# EAGLE design TeensyViewSideTest (EAGLE 7.5.0)
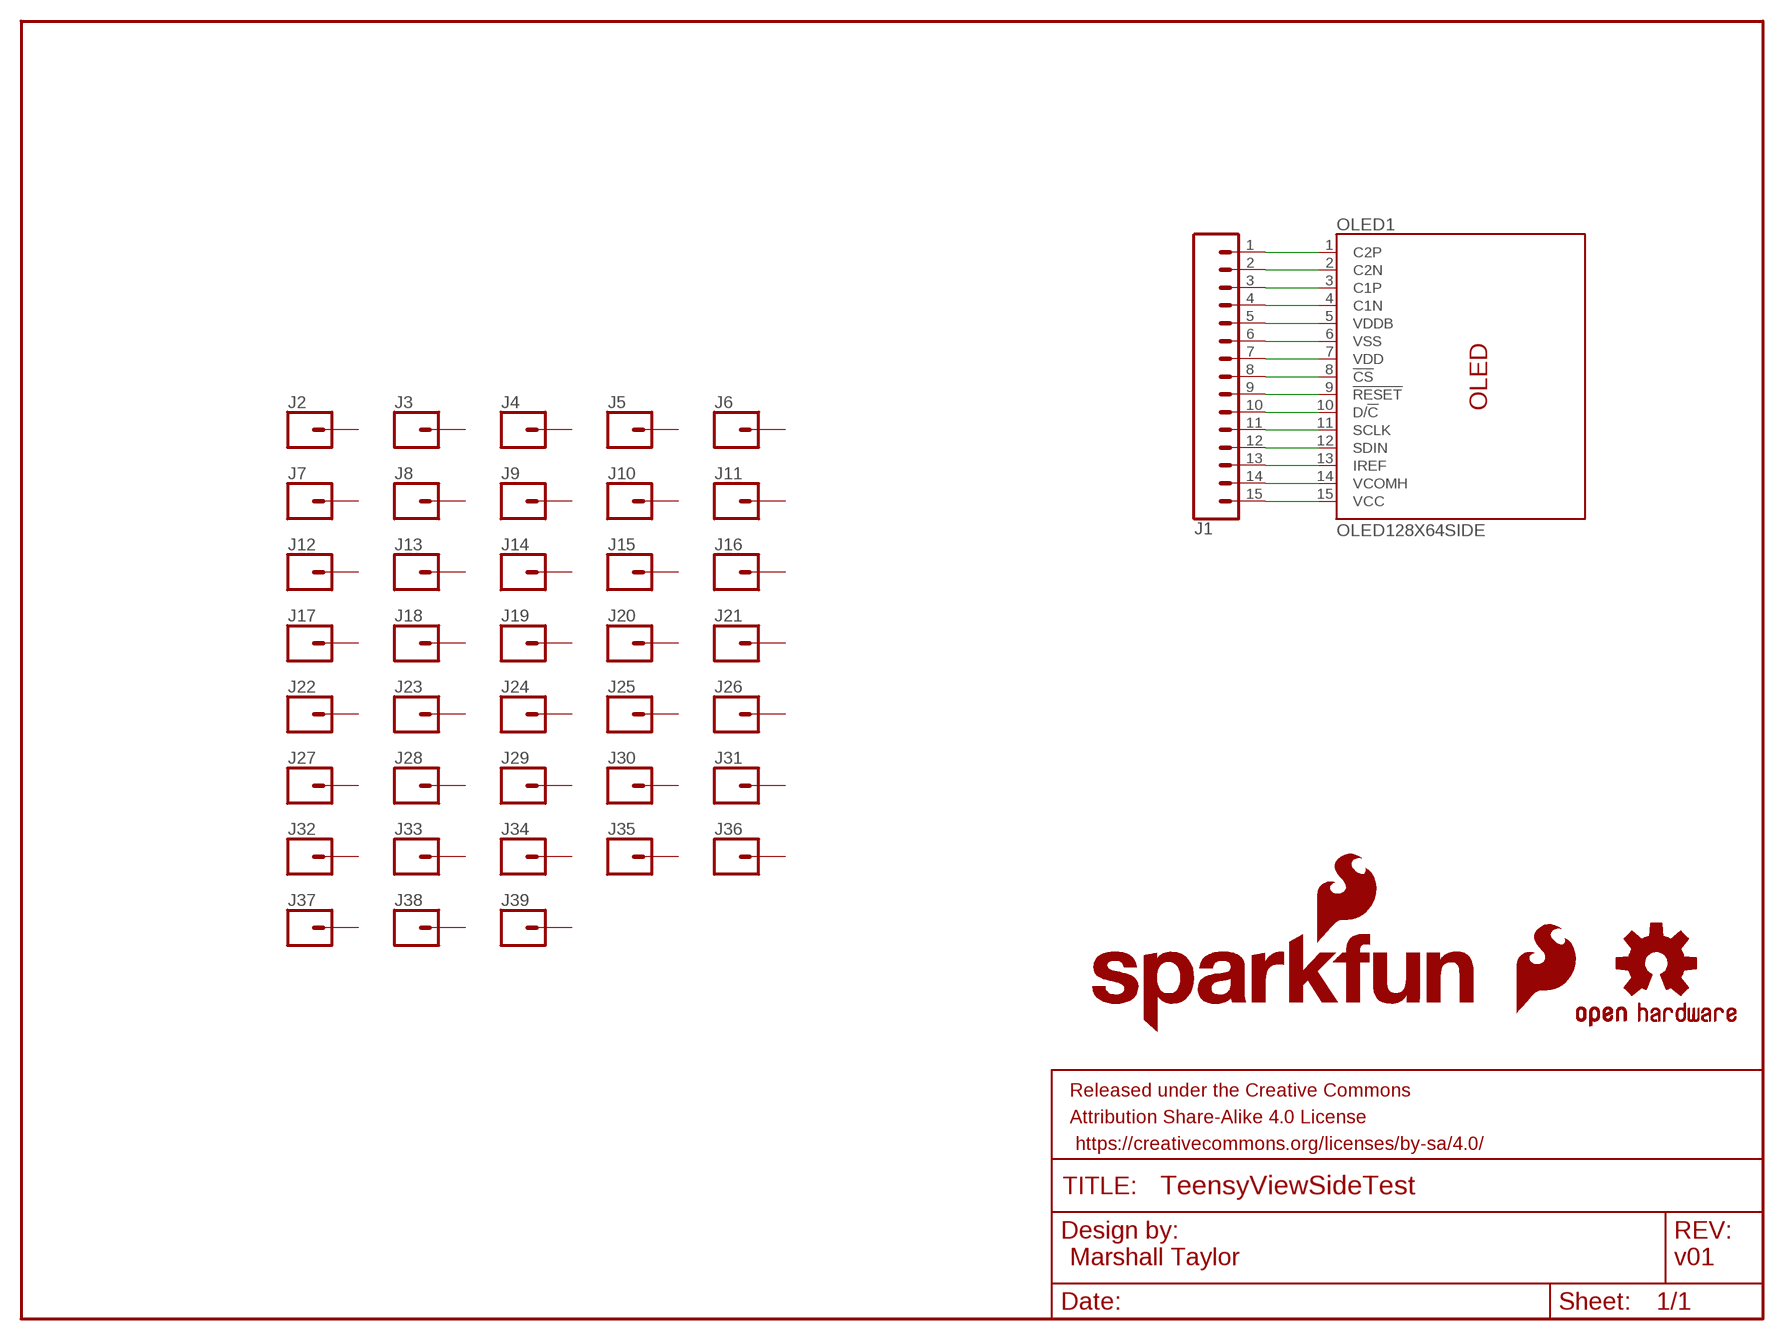
[diagram p0: schematic, sheet 1]

## Parts
FRAME1  FRAME-LETTER  [CREATIVE_COMMONS]
J1  CONN_15  [1X15]
J2  CONN_01PTH_NO_SILK_YES_STOP  [1X01_NO_SILK]
J3  CONN_01PTH_NO_SILK_YES_STOP  [1X01_NO_SILK]
J4  CONN_01PTH_NO_SILK_YES_STOP  [1X01_NO_SILK]
J5  CONN_01PTH_NO_SILK_YES_STOP  [1X01_NO_SILK]
J6  CONN_01PTH_NO_SILK_YES_STOP  [1X01_NO_SILK]
J7  CONN_01PTH_NO_SILK_YES_STOP  [1X01_NO_SILK]
J8  CONN_01PTH_NO_SILK_YES_STOP  [1X01_NO_SILK]
J9  CONN_01PTH_NO_SILK_YES_STOP  [1X01_NO_SILK]
J10  CONN_01PTH_NO_SILK_YES_STOP  [1X01_NO_SILK]
J11  CONN_01PTH_NO_SILK_YES_STOP  [1X01_NO_SILK]
J12  CONN_01PTH_NO_SILK_YES_STOP  [1X01_NO_SILK]
J13  CONN_01PTH_NO_SILK_YES_STOP  [1X01_NO_SILK]
J14  CONN_01PTH_NO_SILK_YES_STOP  [1X01_NO_SILK]
J15  CONN_01PTH_NO_SILK_YES_STOP  [1X01_NO_SILK]
J16  CONN_01PTH_NO_SILK_YES_STOP  [1X01_NO_SILK]
J17  CONN_01PTH_NO_SILK_YES_STOP  [1X01_NO_SILK]
J18  CONN_01PTH_NO_SILK_YES_STOP  [1X01_NO_SILK]
J19  CONN_01PTH_NO_SILK_YES_STOP  [1X01_NO_SILK]
J20  CONN_01PTH_NO_SILK_YES_STOP  [1X01_NO_SILK]
J21  CONN_01PTH_NO_SILK_YES_STOP  [1X01_NO_SILK]
J22  CONN_01PTH_NO_SILK_YES_STOP  [1X01_NO_SILK]
J23  CONN_01PTH_NO_SILK_YES_STOP  [1X01_NO_SILK]
J24  CONN_01PTH_NO_SILK_YES_STOP  [1X01_NO_SILK]
J25  CONN_01PTH_NO_SILK_YES_STOP  [1X01_NO_SILK]
J26  CONN_01PTH_NO_SILK_YES_STOP  [1X01_NO_SILK]
J27  CONN_01PTH_NO_SILK_YES_STOP  [1X01_NO_SILK]
J28  CONN_01PTH_NO_SILK_YES_STOP  [1X01_NO_SILK]
J29  CONN_01PTH_NO_SILK_YES_STOP  [1X01_NO_SILK]
J30  CONN_01PTH_NO_SILK_YES_STOP  [1X01_NO_SILK]
J31  CONN_01PTH_NO_SILK_YES_STOP  [1X01_NO_SILK]
J32  CONN_01PTH_NO_SILK_YES_STOP  [1X01_NO_SILK]
J33  CONN_01PTH_NO_SILK_YES_STOP  [1X01_NO_SILK]
J34  CONN_01PTH_NO_SILK_YES_STOP  [1X01_NO_SILK]
J35  CONN_01PTH_NO_SILK_YES_STOP  [1X01_NO_SILK]
J36  CONN_01PTH_NO_SILK_YES_STOP  [1X01_NO_SILK]
J37  CONN_01PTH_NO_SILK_YES_STOP  [1X01_NO_SILK]
J38  CONN_01PTH_NO_SILK_YES_STOP  [1X01_NO_SILK]
J39  CONN_01PTH_NO_SILK_YES_STOP  [1X01_NO_SILK]
LOGO1  SFE_LOGO_FLAME.1_INCH  [SFE_LOGO_FLAME_.1]
LOGO2  OSHW-LOGOS  [OSHW-LOGO-S]
LOGO3  SFE_LOGO_NAME_FLAME.1_INCH  [SFE_LOGO_NAME_FLAME_.1]
OLED1  OLED128X64SIDE  [OLED-UG-2832TSWGG01]

## Nets
N$1: J1.1 OLED1.1(C2P)
N$2: J1.2 OLED1.2(C2N)
N$3: J1.3 OLED1.3(C1P)
N$4: J1.4 OLED1.4(C1N)
N$5: J1.5 OLED1.5(VDDB)
N$6: J1.6 OLED1.6(VSS)
N$7: J1.7 OLED1.7(VDD)
N$8: J1.8 OLED1.8(!CS!)
N$9: J1.9 OLED1.9(!RESET!)
N$10: J1.10 OLED1.10(D/!C!)
N$11: J1.11 OLED1.11(SCLK)
N$12: J1.12 OLED1.12(SDIN)
N$13: J1.13 OLED1.13(IREF)
N$14: J1.14 OLED1.14(VCOMH)
N$15: J1.15 OLED1.15(VCC)
Unconnected: J2.1 J3.1 J4.1 J5.1 J6.1 J7.1 J8.1 J9.1 J10.1 J11.1 J12.1 J13.1 J14.1 J15.1 J16.1 J17.1 J18.1 J19.1 J20.1 J21.1 J22.1 J23.1 J24.1 J25.1 J26.1 J27.1 J28.1 J29.1 J30.1 J31.1 J32.1 J33.1 J34.1 J35.1 J36.1 J37.1 J38.1 J39.1

## Notes on the sheet
- Marshall Taylor | v01

## Library data of the parts
FRAME1 = SparkFun-Aesthetics:FRAME-LETTER: Schematic Frame - Letter Standard 8.5x11 US Letter frame
J1 = SparkFun-Connectors:CONN_15: Multi connection point. Often used as Generic Header-pin footprint for 0.1 inch spaced/style header connections On any of the 0.1 inch spaced packages, you can populate with these: Break Away Headers - Straight <https://www.sparkfun.com/products/116> (PRT-00116) Break Away Male Headers - Right Angle <https://www.sparkfun.com/products/553> (PRT-00553) Female Headers <https://www.sparkfun.com/products/115> (PRT-00115) Break Away Headers - Machine Pin <https://www.sparkfun.com/products/117> (PRT-00117) Break Away Female Headers - Swiss Machine Pin <https://www.sparkfun.com/products/743> (PRT-00743) For SCREWTERMINALS and SPRING TERMINALS visit here: Screw Terimnals on SparkFun.com <https://www.sparkfun.com/search/results?term=Screw+Terminals> (5mm/3.5mm/2.54mm spacing) This device is also useful as a general connection point to wire up your design to another part of your project. Our various solder wires solder well into these plated through hole pads. Hook-Up Wire - Assortment (Stranded, 22 AWG) <https://www.sparkfun.com/products/11375> (PRT-11375) Hook-Up Wire - Assortment (Solid Core, 22 AWG) <https://www.sparkfun.com/products/11367> (PRT-11367) View the entire wire category on our website here <https://www.sparkfun.com/categories/141> Special notes: Molex polarized connector foot print use with SKU : PRT-08231 with associated crimp pins and housings. 1MM SMD Version SKU: PRT-10208 NOTES ON THE VARIANTS LOCK and LOCK_LONGPADS... This footprint was designed to help hold the alignment of a through-hole component (i.e. 6-pin header) while soldering it into place. You may notice that each hole has been shifted either up or down by 0.005 of an inch from it's more standard position (which is a perfectly straight line). This slight alteration caused the pins (the squares in the middle) to touch the edges of the holes. Because they are alternating, it causes a "brace" to hold the component in place. 0.005 has proven to be the perfect amount of "off-center" position when using our standard breakaway headers. Although looks a little odd when you look at the bare footprint, once you have a header in there, the alteration is very hard to notice. Also,if you push a header all the way into place, it is covered up entirely on the bottom side.
J2-J39 = SparkFun-Connectors:CONN_01: Single connection point. Often used as Generic Header-pin footprint for 0.1 inch spaced/style header connections On any of the 0.1 inch spaced packages, you can populate with these: Break Away Headers - Straight <https://www.sparkfun.com/products/116> (PRT-00116) Break Away Male Headers - Right Angle <https://www.sparkfun.com/products/553> (PRT-00553) Female Headers <https://www.sparkfun.com/products/115> (PRT-00115) Break Away Headers - Machine Pin <https://www.sparkfun.com/products/117> (PRT-00117) Break Away Female Headers - Swiss Machine Pin <https://www.sparkfun.com/products/743> (PRT-00743) This device is also useful as a general connection point to wire up your design to another part of your project. Our various solder wires solder well into these plated through hole pads. Hook-Up Wire - Assortment (Stranded, 22 AWG) <https://www.sparkfun.com/products/11375> (PRT-11375) Hook-Up Wire - Assortment (Solid Core, 22 AWG) <https://www.sparkfun.com/products/11367> (PRT-11367) View the entire wire category on our website here <https://www.sparkfun.com/categories/141> Special notes: SMTSO-256-ET is a "flush mount" nut for a 4-40 screw. We mostly use this on specialty testbeds; it is a nice way to connect hardware to your PCB at an adjustable hieght. Also note, the SNAP packages are for using a snappable style connector. We sell a baggie of snaps and they are also used on two LilyPad designs: Snap Assortment - 30 pack (male and female) <https://www.sparkfun.com/products/11347> (DEV-11347) LilyPad Arduino SimpleSnap <https://www.sparkfun.com/products/10941> (DEV-10941) LilyPad SimpleSnap Protoboard <https://www.sparkfun.com/products/10940> (DEV-10940)
LOGO1 = SparkFun-Aesthetics:SFE_LOGO_FLAME: SparkFun Flame Logo This is the SparkFun flame logo. The logo on the schematic will always be the same size; the package variant is the height of the flame. Default layer for the logo on the board is tSilk.
LOGO2 = SparkFun-Aesthetics:OSHW-LOGO: Open-Source Hardware (OSHW) Logo This logo indicates the piece of hardware it is found on incorporates a OSHW license and/or adheres to the definition of open source hardware found here: http://freedomdefined.org/OSHW
LOGO3 = SparkFun-Aesthetics:SFE_LOGO_NAME_FLAME: SparkFun Font Logo w/ Flame This is the SparkFun full logo. The logo on the schematic will always be the same size; the package variant is the height of the flame part of the logo. Default layer for the logo on the board is tSilk.
OLED1 = SparkFun-Displays:OLED128X64SIDE: Micro OLED TODO: Add description SparkFun Products: Product <https://www.sparkfun.com/products/13003>

## Board
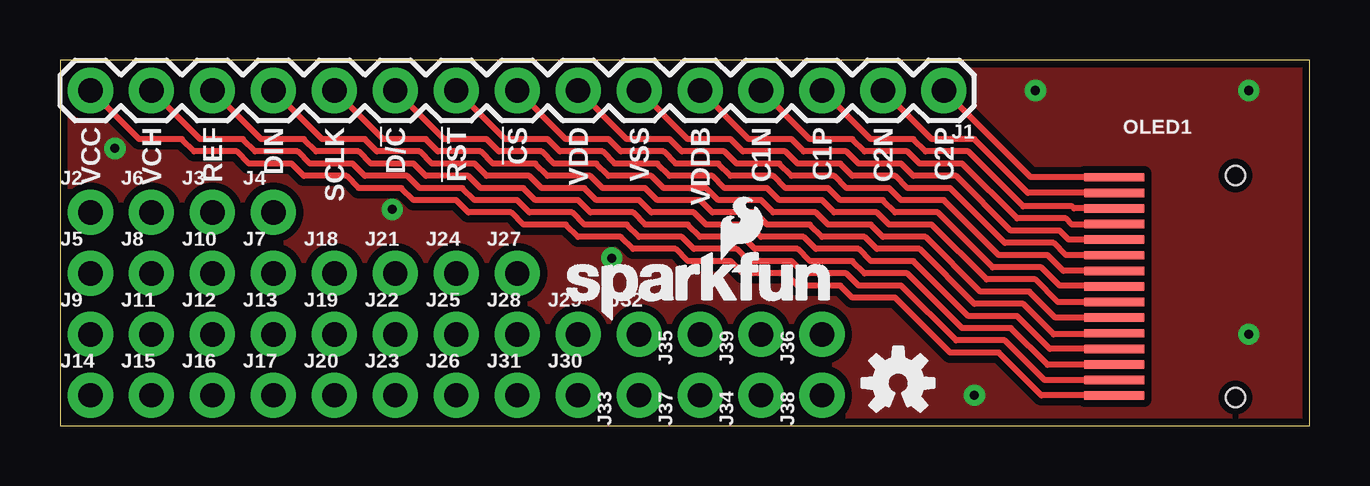
[diagram p1: board, top side]
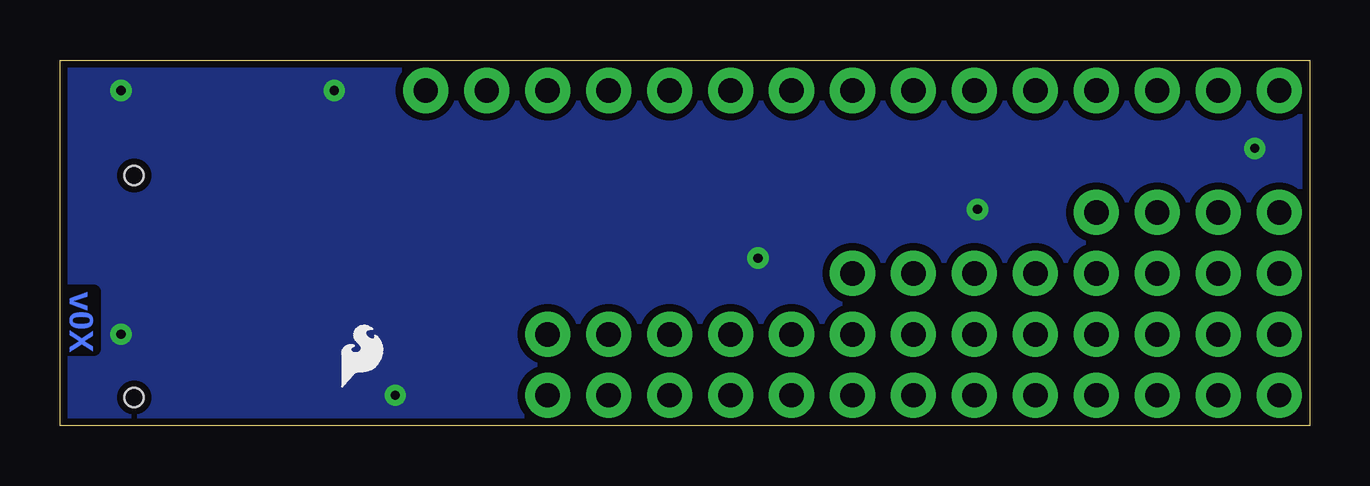
[diagram p2: board, bottom side, seen from below]

Size 52.07 x 15.24 mm. Coordinates in mm from the lower left corner, seen from the top.
Outline: 0,0 52.07,0 52.07,15.24 0,15.24 0,0
Copper layers (1*16): Top 0.035mm / dielectric 1.5mm / Bottom 0.035mm
Design rules "SparkFun-2-layer-STANDARD": minimum track width 10mil, minimum drill 20mil, track to track 10mil, track to pad 8mil, pad to pad 8mil, via to via 10mil, smd to smd 8mil, copper to edge 8mil, drill to drill 8mil, minimum pad ring 10mil, minimum via ring 10mil, stop-mask expansion 4mil, vias tented up to drill 25mil, thermal gap 10mil

### Footprints (pad centres in the part's own frame; a part is rotated, then mirrored left to right if it is on the bottom)
1X15 = drill 1.016 pad 1.88: 1 0,0; 2 2.54,0; 3 5.08,0; 4 7.62,0; 5 10.16,0; 6 12.7,0; 7 15.24,0; 8 17.78,0; 9 20.32,0; 10 22.86,0; 11 25.4,0; 12 27.94,0; 13 30.48,0; 14 33.02,0; 15 35.56,0
1X01_NO_SILK = drill 1.016 pad 1.88: 1 0,0
OLED-UG-2832TSWGG01 = smd 2.5 x 0.35: 1 0.75,-1.075; 2 0.75,-1.725; 3 0.75,-2.375; 4 0.75,-3.025; 5 0.75,-3.675; 6 0.75,-4.325; 7 0.75,-4.975; 8 0.75,-5.625; 9 0.75,-6.275; 10 0.75,-6.925; 11 0.75,-7.575; 12 0.75,-8.225; 13 0.75,-8.875; 14 0.75,-9.525; 15 0.75,-10.175 | hole 0.8: 5.8,-1; 5.8,-10.25

### Placement (x,y rotation side)
FRAME1  -3.81,-11.43 0 top  (outside the outline)
J1  36.83,13.97 180 top
J2  1.27,8.89 0 top
J3  6.35,8.89 0 top
J4  8.89,8.89 0 top
J5  1.27,6.35 0 top
J6  3.81,8.89 0 top
J7  8.89,6.35 0 top
J8  3.81,6.35 0 top
J9  1.27,3.81 0 top
J10  6.35,6.35 0 top
J11  3.81,3.81 0 top
J12  6.35,3.81 0 top
J13  8.89,3.81 0 top
J14  1.27,1.27 0 top
J15  3.81,1.27 0 top
J16  6.35,1.27 0 top
J17  8.89,1.27 0 top
J18  11.43,6.35 0 top
J19  11.43,3.81 0 top
J20  11.43,1.27 0 top
J21  13.97,6.35 0 top
J22  13.97,3.81 0 top
J23  13.97,1.27 0 top
J24  16.51,6.35 0 top
J25  16.51,3.81 0 top
J26  16.51,1.27 0 top
J27  19.05,6.35 0 top
J28  19.05,3.81 0 top
J29  21.59,3.81 0 top
J30  21.59,1.27 0 top
J31  19.05,1.27 0 top
J32  24.13,3.81 0 top
J33  24.13,1.27 90 top
J34  29.21,1.27 90 top
J35  26.67,3.81 90 top
J36  31.75,3.81 90 top
J37  26.67,1.27 90 top
J38  31.75,1.27 90 top
J39  29.21,3.81 90 top
LOGO1  40.64,1.27 0 bottom
LOGO2  34.92,1.78 0 top
LOGO3  20.7,4.32 0 top
OLED1  43.18,11.43 0 top

### Tracks (layer width: path | path; a pad name or v marks a point on that pad's centre or on a via)
GND  (via drill 0.38)
  other vias: 40.64,13.97 49.53,13.97 38.1,1.27 49.53,3.81 22.99,6.99 13.84,9.02 2.29,11.56
  pour Top (isolate 0.305): 0,15.24 52.07,15.24 52.07,0 0,0
  pour Bottom (isolate 0.305): 52.07,15.24 0,15.24 0,0 52.07,0
N$1
  Top 0.254: OLED1.1 40.45,10.36 J1.1
N$2
  Top 0.254: J1.2 36.32,11.94 38.1,11.94 40.33,9.71 OLED1.2
N$3
  Top 0.254: J1.3 33.78,11.94 35.56,11.94 36.07,11.43 37.85,11.43 40.13,9.14 42.16,9.14 42.25,9.05 OLED1.3
N$4
  Top 0.254: J1.4 31.24,11.94 33.02,11.94 33.53,11.43 35.31,11.43 35.81,10.92 37.59,10.92 39.88,8.64 41.91,8.64 42.16,8.38 43.69,8.38 43.71,8.4 OLED1.4
N$5
  Top 0.254: J1.5 28.7,11.94 30.48,11.94 30.99,11.43 32.77,11.43 33.27,10.92 35.05,10.92 35.56,10.41 37.34,10.41 39.62,8.13 41.66,8.13 42.03,7.75 OLED1.5
N$6
  Top 0.254: J1.6 26.16,11.94 27.94,11.94 28.45,11.43 30.23,11.43 30.73,10.92 32.51,10.92 33.02,10.41 34.8,10.41 35.31,9.91 37.08,9.91 39.37,7.62 41.4,7.62 41.91,7.11 43.69,7.11 43.7,7.11 OLED1.6
N$7
  Top 0.254: J1.7 23.62,11.94 25.4,11.94 25.91,11.43 27.69,11.43 28.19,10.92 29.97,10.92 30.48,10.41 32.26,10.41 32.77,9.91 34.54,9.91 35.05,9.4 36.83,9.4 39.12,7.11 41.15,7.11 41.8,6.46 OLED1.7
N$8
  Top 0.254: J1.8 21.08,11.94 22.86,11.94 23.37,11.43 25.15,11.43 25.65,10.92 27.43,10.92 27.94,10.41 29.72,10.41 30.23,9.91 32,9.91 32.51,9.4 34.29,9.4 34.8,8.89 36.58,8.89 38.86,6.6 40.89,6.6 41.66,5.84 43.69,5.84 43.73,5.8 OLED1.8
N$9
  Top 0.254: J1.9 18.54,11.94 20.32,11.94 20.83,11.43 22.61,11.43 23.11,10.92 24.89,10.92 25.4,10.41 27.18,10.41 27.69,9.91 29.46,9.91 29.97,9.4 31.75,9.4 32.26,8.89 34.04,8.89 34.54,8.38 36.32,8.38 38.61,6.1 40.64,6.1 41.58,5.16 OLED1.9
N$10
  Top 0.254: J1.10 16,11.94 17.78,11.94 18.29,11.43 20.07,11.43 20.57,10.92 22.35,10.92 22.86,10.41 24.64,10.41 25.15,9.91 26.92,9.91 27.43,9.4 29.21,9.4 29.72,8.89 31.5,8.89 32,8.38 33.78,8.38 34.29,7.87 36.07,7.87 38.35,5.59 40.39,5.59 41.47,4.5 OLED1.10
N$11
  Top 0.254: J1.11 13.46,11.94 15.24,11.94 15.75,11.43 17.53,11.43 18.03,10.92 19.81,10.92 20.32,10.41 22.1,10.41 22.61,9.91 24.38,9.91 24.89,9.4 26.67,9.4 27.18,8.89 28.96,8.89 29.46,8.38 31.24,8.38 31.75,7.87 33.53,7.87 34.04,7.37 35.81,7.37 38.1,5.08 40.13,5.08 41.4,3.81 43.69,3.81 43.73,3.85 OLED1.11
N$12
  Top 0.254: J1.12 10.92,11.94 12.7,11.94 13.21,11.43 14.99,11.43 15.49,10.92 17.27,10.92 17.78,10.41 19.56,10.41 20.07,9.91 21.84,9.91 22.35,9.4 24.13,9.4 24.64,8.89 26.42,8.89 26.92,8.38 28.7,8.38 29.21,7.87 30.99,7.87 31.5,7.37 33.27,7.37 33.78,6.86 35.56,6.86 37.85,4.57 39.88,4.57 41.24,3.21 OLED1.12
N$13
  Top 0.254: J1.13 8.38,11.94 10.16,11.94 10.67,11.43 12.45,11.43 12.95,10.92 14.73,10.92 15.24,10.41 17.02,10.41 17.53,9.91 19.3,9.91 19.81,9.4 21.59,9.4 22.1,8.89 23.88,8.89 24.38,8.38 26.16,8.38 26.67,7.87 28.45,7.87 28.96,7.37 30.73,7.37 31.24,6.86 33.02,6.86 33.53,6.35 35.31,6.35 37.59,4.06 39.62,4.06 41.15,2.54 43.69,2.54 43.7,2.56 OLED1.13
N$14
  Top 0.254: OLED1.14 41.02,1.91 39.37,3.56 37.34,3.56 35.05,5.84 33.27,5.84 32.77,6.35 30.99,6.35 30.48,6.86 28.7,6.86 28.19,7.37 26.42,7.37 25.91,7.87 24.13,7.87 23.62,8.38 21.84,8.38 21.34,8.89 19.56,8.89 19.05,9.4 17.27,9.4 16.76,9.91 14.99,9.91 14.48,10.41 12.7,10.41 12.19,10.92 10.41,10.92 9.91,11.43 8.13,11.43 7.62,11.94 5.84,11.94 J1.14
N$15
  Top 0.254: J1.15 3.3,11.94 5.08,11.94 5.59,11.43 7.37,11.43 7.87,10.92 9.65,10.92 10.16,10.41 11.94,10.41 12.45,9.91 14.22,9.91 14.73,9.4 16.51,9.4 17.02,8.89 18.8,8.89 19.3,8.38 21.08,8.38 21.59,7.87 23.37,7.87 23.88,7.37 25.65,7.37 26.16,6.86 27.94,6.86 28.45,6.35 30.23,6.35 30.73,5.84 32.51,5.84 33.02,5.33 34.8,5.33 37.08,3.05 39.12,3.05 40.89,1.27 43.69,1.27 43.7,1.25 OLED1.15

### Text on the board
Bottom: v0X
tPlace: VCC | VCH | REF | DIN | SCLK | D/!C | !RST | !CS | VDD | VSS | VDDB | C1N | C1P | C2N | C2P
tDocu: Marshall Taylor